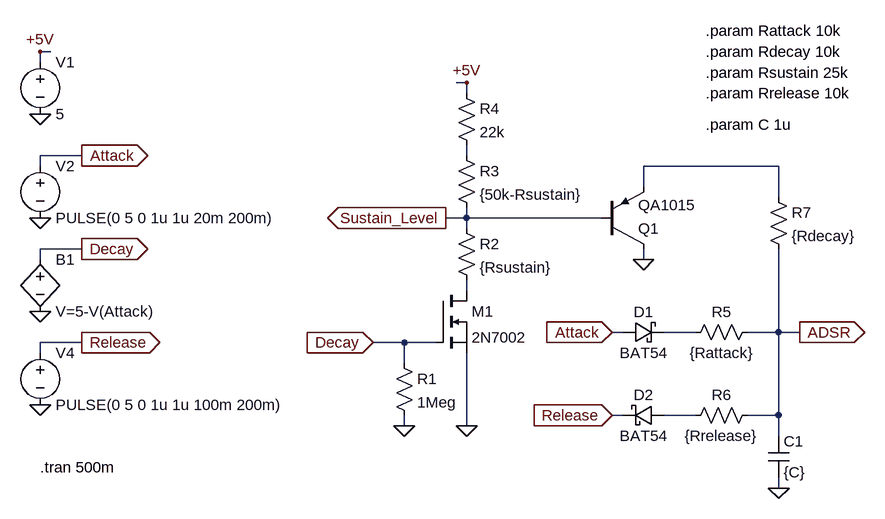
[diagram p0: schematic ADSR.asc]
ADSR.asc, the LTspice schematic file:
Version 4
SHEET 1 892 680
WIRE -384 -336 -400 -336
WIRE -400 -320 -400 -336
WIRE 256 -288 240 -288
WIRE 256 -272 256 -288
WIRE -336 -176 -400 -176
WIRE 256 -176 256 -192
WIRE -400 -160 -400 -176
WIRE 736 -160 528 -160
WIRE 528 -128 528 -160
WIRE 736 -112 736 -160
WIRE 256 -80 256 -96
WIRE 256 -80 224 -80
WIRE 464 -80 256 -80
WIRE 256 -64 256 -80
WIRE -336 -32 -400 -32
WIRE -400 -16 -400 -32
WIRE 528 -16 528 -32
WIRE 256 32 256 16
WIRE 496 96 480 96
WIRE 608 96 560 96
WIRE 736 96 736 -32
WIRE 736 96 688 96
WIRE 768 96 736 96
WIRE -336 112 -400 112
WIRE 160 112 112 112
WIRE 208 112 160 112
WIRE -400 128 -400 112
WIRE 160 144 160 112
WIRE 496 224 480 224
WIRE 608 224 560 224
WIRE 736 224 736 96
WIRE 736 224 688 224
WIRE 160 240 160 224
WIRE 256 240 256 128
WIRE 736 256 736 224
WIRE 736 336 736 320
FLAG 112 112 Decay
IOPIN 112 112 In
FLAG 256 -288 +5V
FLAG 160 240 0
FLAG 256 240 0
FLAG 528 -16 0
FLAG 480 96 Attack
IOPIN 480 96 In
FLAG 480 224 Release
IOPIN 480 224 In
FLAG 736 336 0
FLAG 768 96 ADSR
IOPIN 768 96 Out
FLAG -400 -336 +5V
FLAG -400 -240 0
FLAG -336 -176 Attack
IOPIN -336 -176 Out
FLAG -400 -80 0
FLAG -336 -32 Decay
IOPIN -336 -32 Out
FLAG -336 112 Release
IOPIN -336 112 Out
FLAG -400 208 0
FLAG -400 64 0
FLAG 224 -80 Sustain_Level
IOPIN 224 -80 Out
SYMBOL res 144 128 R0
SYMATTR InstName R1
SYMATTR Value 1Meg
SYMBOL nmos 208 32 R0
SYMATTR InstName M1
SYMATTR Value 2N7002
SYMBOL res 240 -80 R0
SYMATTR InstName R2
SYMATTR Value {Rsustain}
SYMBOL res 240 -192 R0
SYMATTR InstName R3
SYMATTR Value {50k-Rsustain}
SYMBOL res 240 -288 R0
SYMATTR InstName R4
SYMATTR Value 22k
SYMBOL schottky 496 112 R270
WINDOW 0 32 32 VTop 2
WINDOW 3 0 32 VBottom 2
SYMATTR InstName D1
SYMATTR Value BAT54
SYMBOL res 704 80 R90
WINDOW 0 0 56 VBottom 2
WINDOW 3 32 56 VTop 2
SYMATTR InstName R5
SYMATTR Value {Rattack}
SYMBOL schottky 560 240 M270
WINDOW 0 32 32 VTop 2
WINDOW 3 0 32 VBottom 2
SYMATTR InstName D2
SYMATTR Value BAT54
SYMBOL res 704 208 R90
WINDOW 0 0 56 VBottom 2
WINDOW 3 32 56 VTop 2
SYMATTR InstName R6
SYMATTR Value {Rrelease}
SYMBOL res 720 -128 R0
SYMATTR InstName R7
SYMATTR Value {Rdecay}
SYMBOL cap 720 256 R0
SYMATTR InstName C1
SYMATTR Value {C}
SYMBOL voltage -400 -336 R0
WINDOW 123 0 0 Left 0
WINDOW 39 0 0 Left 0
SYMATTR InstName V1
SYMATTR Value 5
SYMBOL voltage -400 -176 R0
WINDOW 123 0 0 Left 0
WINDOW 39 0 0 Left 0
SYMATTR InstName V2
SYMATTR Value PULSE(0 5 0 1u 1u 20m 200m)
SYMBOL voltage -400 112 R0
WINDOW 123 0 0 Left 0
WINDOW 39 0 0 Left 0
SYMATTR InstName V4
SYMATTR Value PULSE(0 5 0 1u 1u 100m 200m)
SYMBOL pnp 464 -32 M180
SYMATTR InstName Q1
SYMATTR Value QA1015
SYMBOL bv -400 -32 R0
SYMATTR InstName B1
SYMATTR Value V=5-V(Attack)
TEXT 624 -368 Left 2 !.param Rattack 10k
TEXT 624 -336 Left 2 !.param Rdecay 10k
TEXT 624 -304 Left 2 !.param Rsustain 25k
TEXT 624 -272 Left 2 !.param Rrelease 10k
TEXT -400 304 Left 2 !.tran 500m
TEXT 624 -224 Left 2 !.param C 1u

The netlist it stands for:
* ADSR.asc
R1 Decay 0 1Meg
M1 N003 Decay 0 0 2N7002
R2 Sustain_Level N003 {Rsustain}
R3 N001 Sustain_Level {50k-Rsustain}
R4 +5V N001 22k
D1 Attack N004 BAT54
R5 ADSR N004 {Rattack}
D2 N005 Release BAT54
R6 ADSR N005 {Rrelease}
R7 N002 ADSR {Rdecay}
C1 ADSR 0 {C}
V1 +5V 0 5
V2 Attack 0 PULSE(0 5 0 1u 1u 20m 200m)
V4 Release 0 PULSE(0 5 0 1u 1u 100m 200m)
Q1 0 Sustain_Level N002 0 QA1015
B1 Decay 0 V=5-V(Attack)
.model D D
.lib standard.dio
.model NPN NPN
.model PNP PNP
.lib standard.bjt
.model NMOS NMOS
.model PMOS PMOS
.lib standard.mos
.param Rattack 10k
.param Rdecay 10k
.param Rsustain 25k
.param Rrelease 10k
.tran 500m
.param C 1u
.backanno
.end